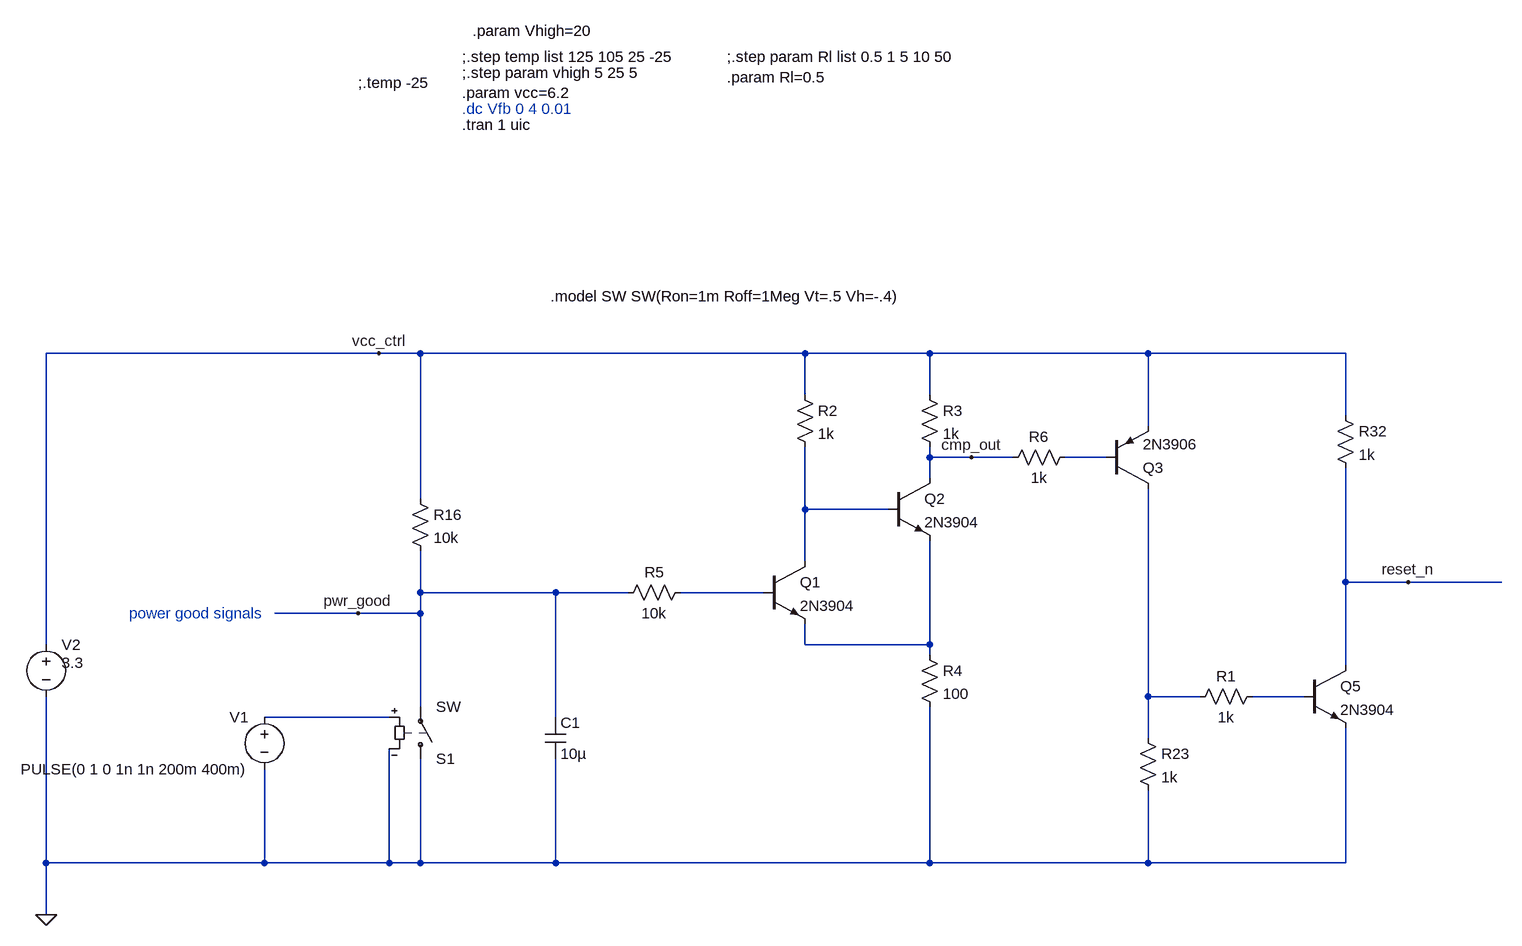
[diagram p0: schematic reset_logic.asc]
reset_logic.asc, the LTspice schematic file:
Version 4.1
SHEET 1 5252 3804
WIRE -448 -240 -960 -240
WIRE -384 -240 -448 -240
WIRE 208 -240 -384 -240
WIRE 400 -240 208 -240
WIRE 736 -240 400 -240
WIRE 1040 -240 736 -240
WIRE 208 -176 208 -240
WIRE 400 -176 400 -240
WIRE 1040 -144 1040 -240
WIRE 736 -128 736 -240
WIRE 400 -80 400 -96
WIRE 464 -80 400 -80
WIRE 528 -80 464 -80
WIRE 672 -80 608 -80
WIRE 400 -48 400 -80
WIRE -384 -16 -384 -240
WIRE 208 0 208 -96
WIRE 336 0 208 0
WIRE 208 80 208 0
WIRE 1040 112 1040 -64
WIRE 1136 112 1040 112
WIRE 1280 112 1136 112
WIRE -384 128 -384 64
WIRE -176 128 -384 128
WIRE -64 128 -176 128
WIRE 144 128 16 128
WIRE -480 160 -608 160
WIRE -384 160 -384 128
WIRE -384 160 -480 160
WIRE -960 208 -960 -240
WIRE 208 208 208 176
WIRE 400 208 400 48
WIRE 400 208 208 208
WIRE 400 224 400 208
WIRE 1040 240 1040 112
WIRE 736 288 736 -32
WIRE 816 288 736 288
WIRE 976 288 896 288
WIRE -384 304 -384 160
WIRE -432 320 -624 320
WIRE -176 320 -176 128
WIRE 736 352 736 288
WIRE -960 544 -960 288
WIRE -624 544 -624 400
WIRE -624 544 -960 544
WIRE -432 544 -432 368
WIRE -432 544 -624 544
WIRE -384 544 -384 384
WIRE -384 544 -432 544
WIRE -176 544 -176 384
WIRE -176 544 -384 544
WIRE 400 544 400 304
WIRE 400 544 -176 544
WIRE 736 544 736 432
WIRE 736 544 400 544
WIRE 1040 544 1040 336
WIRE 1040 544 736 544
WIRE -960 624 -960 544
FLAG -960 624 0
FLAG 464 -80 cmp_out
FLAG -448 -240 vcc_ctrl
FLAG 1136 112 reset_n
FLAG -480 160 pwr_good
SYMBOL npn 144 80 R0
SYMATTR InstName Q1
SYMATTR Value 2N3904
SYMBOL npn 336 -48 R0
SYMATTR InstName Q2
SYMATTR Value 2N3904
SYMBOL res 192 -192 R0
SYMATTR InstName R2
SYMATTR Value 1k
SYMBOL res 384 -192 R0
SYMATTR InstName R3
SYMATTR Value 1k
SYMBOL res 384 208 R0
SYMATTR InstName R4
SYMATTR Value 100
SYMBOL voltage -960 192 R0
WINDOW 3 24 44 Left 2
WINDOW 123 0 0 Left 0
WINDOW 39 0 0 Left 0
SYMATTR Value 3.3
SYMATTR InstName V2
SYMBOL res 624 -96 R90
WINDOW 0 0 56 VBottom 2
WINDOW 3 32 56 VTop 2
SYMATTR InstName R6
SYMATTR Value 1k
SYMBOL npn 976 240 R0
SYMATTR InstName Q5
SYMATTR Value 2N3904
SYMBOL res 720 336 R0
SYMATTR InstName R23
SYMATTR Value 1k
SYMBOL res 1024 -160 R0
SYMATTR InstName R32
SYMATTR Value 1k
SYMBOL sw -384 400 M180
SYMATTR InstName S1
SYMBOL voltage -624 304 M0
WINDOW 123 0 0 Left 0
WINDOW 39 0 0 Left 0
SYMATTR InstName V1
SYMATTR Value PULSE(0 1 0 1n 1n 200m 400m)
SYMBOL res -400 -32 R0
SYMATTR InstName R16
SYMATTR Value 10k
SYMBOL cap -192 320 R0
SYMATTR InstName C1
SYMATTR Value 10µ
SYMBOL pnp 672 -32 M180
SYMATTR InstName Q3
SYMATTR Value 2N3906
SYMBOL res 912 272 R90
WINDOW 0 0 56 VBottom 2
WINDOW 3 32 56 VTop 2
SYMATTR InstName R1
SYMATTR Value 1k
SYMBOL res 32 112 R90
WINDOW 0 0 56 VBottom 2
WINDOW 3 32 56 VTop 2
SYMATTR InstName R5
SYMATTR Value 10k
TEXT -320 -616 Left 2 ;.dc Vfb 0 4 0.01
TEXT -320 -672 Left 2 !;.step param vhigh 5 25 5\n.param vcc=6.2
TEXT -320 -696 Left 2 !;.step temp list 125 105 25 -25
TEXT -320 -592 Left 2 !.tran 1 uic
TEXT -304 -736 Left 2 !.param Vhigh=20
TEXT 88 -696 Left 2 !;.step param Rl list 0.5 1 5 10 50\n.param Rl=0.5
TEXT -184 -328 Left 2 !.model SW SW(Ron=1m Roff=1Meg Vt=.5 Vh=-.4)
TEXT -480 -656 Left 2 !;.temp -25
TEXT -832 160 Left 2 ;power good signals

The netlist it stands for:
* reset_logic.asc
Q1 N002 N003 N004 0 2N3904
Q2 cmp_out N002 N004 0 2N3904
R2 vcc_ctrl N002 1k
R3 vcc_ctrl cmp_out 1k
R4 N004 0 100
V2 vcc_ctrl 0 3.3
R6 N001 cmp_out 1k
Q5 reset_n N006 0 0 2N3904
R23 N005 0 1k
R32 vcc_ctrl reset_n 1k
S1 0 pwr_good N007 0 SW
V1 N007 0 PULSE(0 1 0 1n 1n 200m 400m)
R16 vcc_ctrl pwr_good 10k
C1 pwr_good 0 10µ
Q3 N005 N001 vcc_ctrl 0 2N3906
R1 N006 N005 1k
R5 N003 pwr_good 10k
.model NPN NPN
.model PNP PNP
.lib standard.bjt
* .dc Vfb 0 4 0.01
;.step param vhigh 5 25 5
.param vcc=6.2
;.step temp list 125 105 25 -25
.tran 1 uic
.param Vhigh=20
;.step param Rl list 0.5 1 5 10 50
.param Rl=0.5
.model SW SW(Ron=1m Roff=1Meg Vt=.5 Vh=-.4)
;.temp -25
* power good signals
.backanno
.end